# EAGLE design HKCV4 (EAGLE 9.6.2)
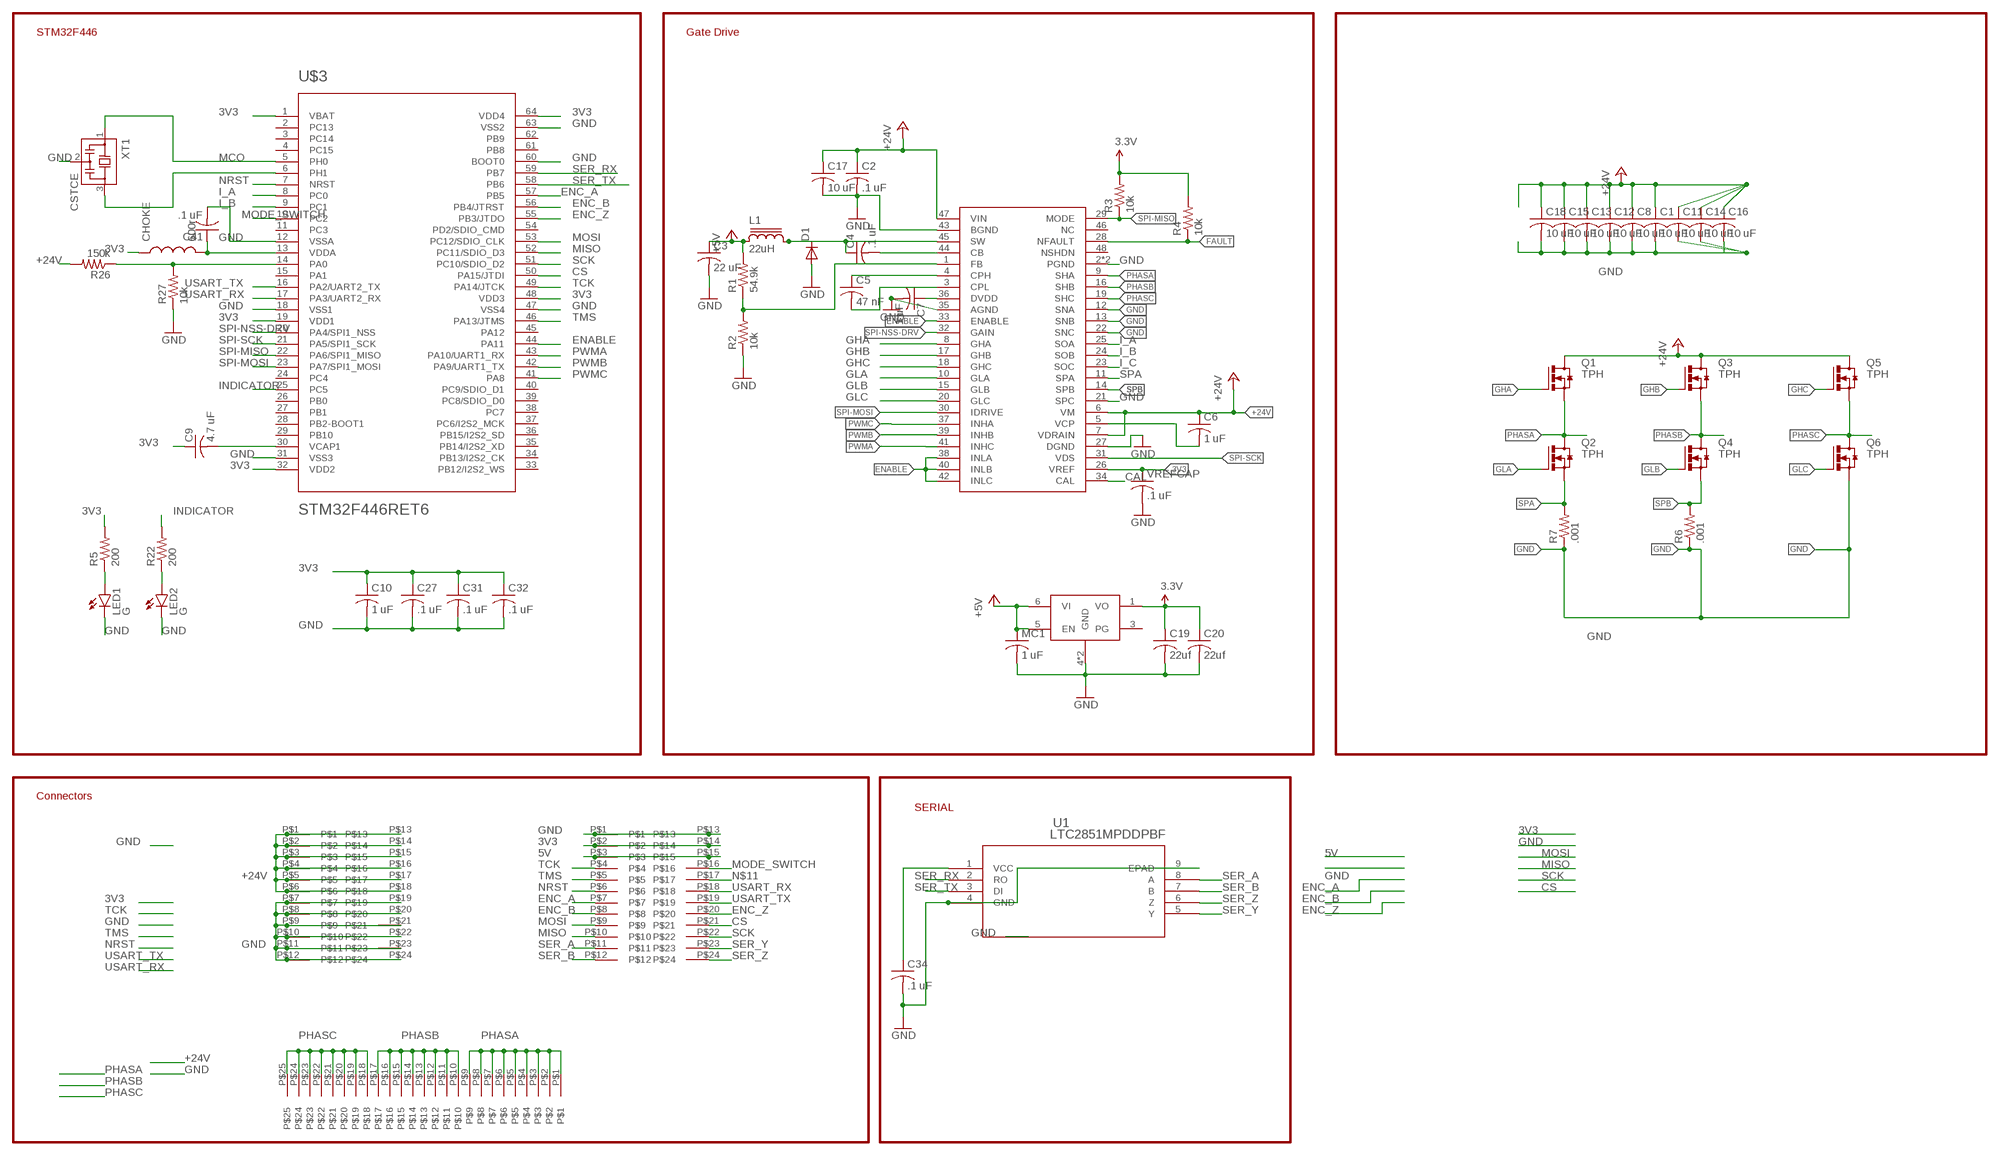
[diagram p0: schematic, sheet 1]

## Parts
C1  10 uF  C-USC1206K  [C1206K]
C2  .1 uF  C-USC0402K  [C0402K]
C3  22 uF  C-USC0603K  [C0603K]
C4  .1 uF  C-USC0402K  [C0402K]
C5  47 nF  C-USC0402K  [C0402K]
C6  1 uF  C-USC0603K  [C0603K]
C7  1 uF  C-USC0402K  [C0402K]
C8  10 uF  C-USC1206K  [C1206K]
C9  4.7 uF  C-USC0402K  [C0402K]
C10  1 uF  C-USC0402K  [C0402K]
C11  10 uF  C-USC1206K  [C1206K]
C12  10 uF  C-USC1206K  [C1206K]
C13  10 uF  C-USC1206K  [C1206K]
C14  10 uF  C-USC1206K  [C1206K]
C15  10 uF  C-USC1206K  [C1206K]
C16  10 uF  C-USC1206K  [C1206K]
C17  10 uF  C-USC1206K  [C1206K]
C18  10 uF  C-USC1206K  [C1206K]
C19  22uf  C-USC0603K  [C0603K]
C20  22uf  C-USC0603K  [C0603K]
C27  .1 uF  C-USC0402K  [C0402K]
C31  .1 uF  C-USC0402K  [C0402K]
C32  .1 uF  C-USC0402K  [C0402K]
C34  .1 uF  C-USC0402K  [C0402K]
C41  .1 uF  C-USC0402K  [C0402K]
CHOKE  600r  INDUCTOR0603  [0603]
D1  DIODE-SOD123  [SOD123]
L1  22uH  SDR0302  [SDR0302]
LED1  G  LED0603  [LED-0603]
LED2  G  LED0603  [LED-0603]
MC1  1 uF  C-USC0402K  [C0402K]
Q1  TPH  [TRANS_TPH5900CNH,L1Q]
Q2  TPH  [TRANS_TPH5900CNH,L1Q]
Q3  TPH  [TRANS_TPH5900CNH,L1Q]
Q4  TPH  [TRANS_TPH5900CNH,L1Q]
Q5  TPH  [TRANS_TPH5900CNH,L1Q]
Q6  TPH  [TRANS_TPH5900CNH,L1Q]
R1  54.9k  R-US_R0402  [R0402]
R2  10k  R-US_R0402  [R0402]
R3  10k  R-US_R0402  [R0402]
R4  10k  R-US_R0402  [R0402]
R5  200  R-US_R0402  [R0402]
R6  .001  R-US_R1210  [R1210]
R7  .001  R-US_R1210  [R1210]
R22  200  R-US_R0402  [R0402]
R26  150k  R-US_R0402  [R0402]
R27  10k  R-US_R0402  [R0402]
U1  LTC2851MPDDPBF  [DFN-8_DD]
U$1  DRV8323RH  [QFN50P700X700X90-49N]
U$2  HEADER_2X12  [2X12X.05]
U$3  STM32F446RET6  [TQFP64]
U$4  HEADER_1X25  [1X25X.05]
U$5  HEADER_2X12  [2X12X.05]
U$7  LDFM  [DFN6-3X3]
VREFCAP  .1 uF  C-USC0402K  [C0402K]
XT1  CSTCE  [CSTCE]

## Nets
3V3: C9.1 C10.1 C19.1 C20.1 C27.1 C31.1 C32.1 C34.1 CHOKE.1 R3.2 R4.2 R5.2 U1.1(VCC) U$1.26(VREF) U$2.P$2 U$2.P$14 U$3.1(VBAT) U$3.19(VDD1) U$3.32(VDD2) U$3.48(VDD3) U$3.64(VDD4) U$7.1(VO) VREFCAP.1 ; supply symbol labelled 3.3V
5V: C3.1 L1.1 MC1.1 R1.2 U$2.P$3 U$2.P$15 U$7.5(EN) U$7.6(VI) ; supply symbol labelled +5V
+24V: C1.1 C2.1 C6.1 C8.1 C11.1 C12.1 C13.1 C14.1 C15.1 C16.1 C17.1 C18.1 Q1.5(D) Q1.6(D) Q1.7(D) Q1.8(D) Q1.EP(D) Q3.5(D) Q3.6(D) Q3.7(D) Q3.8(D) Q3.EP(D) Q5.5(D) Q5.6(D) Q5.7(D) Q5.8(D) Q5.EP(D) R26.2 U$1.6(VM) U$1.7(VDRAIN) U$1.47(VIN) U$5.P$1 U$5.P$2 U$5.P$3 U$5.P$4 U$5.P$5 U$5.P$6 U$5.P$13 U$5.P$14 U$5.P$15 U$5.P$16 U$5.P$17 U$5.P$18
BOOT: C4.2 U$1.44(CB)
CAL: U$1.34(CAL)
CPH: C5.1 U$1.4(CPH)
CPL: C5.2 U$1.3(CPL)
CS: U$2.P$21 U$3.50(PA15/JTDI)
DEVICE3.3: C7.1 U$1.36(DVDD)
ENABLE: U$1.33(ENABLE) U$1.38(INLA) U$1.40(INLB) U$1.42(INLC) U$3.44(PA11)
ENC_A: U$2.P$7 U$3.57(PB5)
ENC_B: U$2.P$8 U$3.56(PB4/JTRST)
ENC_Z: U$2.P$20 U$3.55(PB3/JTDO)
FAULT: R4.1 U$1.28(NFAULT)
FB: R1.1 R2.2 U$1.1(FB)
GHA: Q1.4(G) U$1.8(GHA)
GHB: Q3.4(G) U$1.17(GHB)
GHC: Q5.4(G) U$1.18(GHC)
GLA: Q2.4(G) U$1.10(GLA)
GLB: Q4.4(G) U$1.15(GLB)
GLC: Q6.4(G) U$1.20(GLC)
GND: C1.2 C2.2 C3.2 C7.2 C8.2 C10.2 C11.2 C12.2 C13.2 C14.2 C15.2 C16.2 C17.2 C18.2 C19.2 C20.2 C27.2 C31.2 C32.2 C34.2 C41.2 D1.A LED1.C LED2.C MC1.2 Q6.1(S) Q6.2(S) Q6.3(S) R2.1 R6.1 R7.1 R27.1 U1.4(GND) U1.9(EPAD) U$1.2(PGND) U$1.12(SNA) U$1.13(SNB) U$1.21(SPC) U$1.22(SNC) U$1.27(DGND) U$1.35(AGND) U$1.43(BGND) U$1.49(PGND) U$2.P$1 U$2.P$13 U$3.12(VSSA) U$3.18(VSS1) U$3.31(VSS3) U$3.47(VSS4) U$3.60(BOOT0) U$3.63(VSS2) U$5.P$7 U$5.P$8 U$5.P$9 U$5.P$10 U$5.P$11 U$5.P$12 U$5.P$19 U$5.P$20 U$5.P$21 U$5.P$22 U$5.P$23 U$5.P$24 U$7.4(GND) U$7.EXP(GND) VREFCAP.2 XT1.2
I_A: U$1.25(SOA) U$3.8(PC0)
I_B: U$1.24(SOB) U$3.9(PC1)
I_C: U$1.23(SOC)
INDICATOR: R22.2 U$3.25(PC5)
MCO: U$3.5(PH0) XT1.1
MISO: U$2.P$10 U$3.52(PC11/SDIO_D3)
MODE_SWITCH: U$2.P$16 U$3.10(PC2)
MOSI: U$2.P$9 U$3.53(PC12/SDIO_CLK)
N$1: LED1.A R5.1
N$2: C41.1 CHOKE.2 U$3.13(VDDA)
N$3: C9.2 U$3.30(VCAP1)
N$11: U$2.P$17
N$24: R26.1 R27.2 U$3.14(PA0)
N$28: LED2.A R22.1
N$30: U$3.6(PH1) XT1.3
NRST: U$2.P$6 U$3.7(NRST)
PHASA: Q1.1(S) Q1.2(S) Q1.3(S) Q2.5(D) Q2.6(D) Q2.7(D) Q2.8(D) Q2.EP(D) U$1.9(SHA) U$4.P$1 U$4.P$2 U$4.P$3 U$4.P$4 U$4.P$5 U$4.P$6 U$4.P$7 U$4.P$8 U$4.P$9
PHASB: Q3.1(S) Q3.2(S) Q3.3(S) Q4.5(D) Q4.6(D) Q4.7(D) Q4.8(D) Q4.EP(D) U$1.16(SHB) U$4.P$10 U$4.P$11 U$4.P$12 U$4.P$13 U$4.P$14 U$4.P$15 U$4.P$16 U$4.P$17
PHASC: Q5.1(S) Q5.2(S) Q5.3(S) Q6.5(D) Q6.6(D) Q6.7(D) Q6.8(D) Q6.EP(D) U$1.19(SHC) U$4.P$18 U$4.P$19 U$4.P$20 U$4.P$21 U$4.P$22 U$4.P$23 U$4.P$24 U$4.P$25
PWMA: U$1.41(INHC) U$3.43(PA10/UART1_RX)
PWMB: U$1.39(INHB) U$3.42(PA9/UART1_TX)
PWMC: U$1.37(INHA) U$3.41(PA8)
SCK: U$2.P$22 U$3.51(PC10/SDIO_D2)
SER_A: U1.8(A) U$2.P$11
SER_B: U1.7(B) U$2.P$12
SER_RX: U1.2(RO) U$3.59(PB7)
SER_TX: U1.3(DI) U$3.58(PB6)
SER_Y: U1.5(Y) U$2.P$23
SER_Z: U1.6(Z) U$2.P$24
SPA: Q2.1(S) Q2.2(S) Q2.3(S) R7.2 U$1.11(SPA)
SPB: Q4.1(S) Q4.2(S) Q4.3(S) R6.2 U$1.14(SPB)
SPI-MISO: R3.1 U$1.29(MODE) U$3.22(PA6/SPI1_MISO)
SPI-MOSI: U$1.30(IDRIVE) U$3.23(PA7/SPI1_MOSI)
SPI-NSS-DRV: U$1.32(GAIN) U$3.20(PA4/SPI1_NSS)
SPI-SCK: U$1.31(VDS) U$3.21(PA5/SPI1_SCK)
SW: C4.1 D1.C L1.2 U$1.45(SW)
TCK: U$2.P$4 U$3.49(PA14/JTCK)
TMS: U$2.P$5 U$3.46(PA13/JTMS)
USART_RX: U$2.P$18 U$3.17(PA3/UART2_RX)
USART_TX: U$2.P$19 U$3.16(PA2/UART2_TX)
VCP: C6.2 U$1.5(VCP)
Unconnected: U$1.46(NC) U$1.48(NSHDN) U$3.2(PC13) U$3.3(PC14) U$3.4(PC15) U$3.11(PC3) U$3.15(PA1) U$3.24(PC4) U$3.26(PB0) U$3.27(PB1) U$3.28(PB2-BOOT1) U$3.29(PB10) U$3.33(PB12/I2S2_WS) U$3.34(PB13/I2S2_CK) U$3.35(PB14/I2S2_XD) U$3.36(PB15/I2S2_SD) U$3.37(PC6/I2S2_MCK) U$3.38(PC7) U$3.39(PC8/SDIO_D0) U$3.40(PC9/SDIO_D1) U$3.45(PA12) U$3.54(PD2/SDIO_CMD) U$3.61(PB8) U$3.62(PB9) U$7.3(PG)

## Notes on the sheet
- STM32F446 | Gate Drive
- Connectors
- SERIAL

## Library data of the parts
C1-C20 C27 C31 C32 C34 C41 MC1 VREFCAP = rcl:C-US: CAPACITOR, American symbol
CHOKE = SparkFun-Passives:INDUCTOR: Inductors Basic Inductor/Choke - 0603 and 1206. Footprints are not proven and vary greatly between part numbers. INDUCTOR POWER 3.3UH 4.0A SMD 0.197" L x 0.197" W x 0.177" H (5.00mm x 5.00mm x 4.50mm)
D1 = diode:DIODE-: DIODE
L1 = inductor-bourns:SDR0302: POWER INDUCTOR
LED1 LED2 = SparkFun-LED:LED: LEDs Standard schematic elements and footprints for 5mm, 3mm, 1206, and 0603 sized LEDs. 5mm - Spark Fun Electronics SKU : COM-00529 (and others)
Q1-Q6 = transistor-power:TPH
R1-R7 R22 R26 R27 = rcl:R-US_: RESISTOR, American symbol
U1 = LTC2851MPDDPBF:LTC2851MPDDPBF; DESCRIPTION: LTC2851 - 3.3V 20Mbps RS485/RS422 Transceiver; DIGI-KEY_PART_NUMBER: LTC2851MPDD#PBF-ND; DIGI-KEY_PURCHASE_URL: https://www.digikey.com/product-detail/en/linear-technology-analog-devices/LTC2851MPDD-PBF/LTC2851MPDD-PBF-ND/2297587?utm_source=snapeda&utm_medium=aggregator&utm_campaign=symbol; MF: Linear Technology; MP: LTC2851MPDD#PBF; PACKAGE: DFN-8 Linear Technology
U$1 = BenLibrary:DRV8323RH
U$2 U$5 = Ben_Library:HEADER_2X12
U$3 = BenLibrary:STM32F446RET6: ARM DSP Chip used on the WAV Trigger board.
U$4 = Ben_Library:HEADER_1X25
U$7 = BenLibrary:LDFM
XT1 = sc_usercreated:CSTCE

## Board
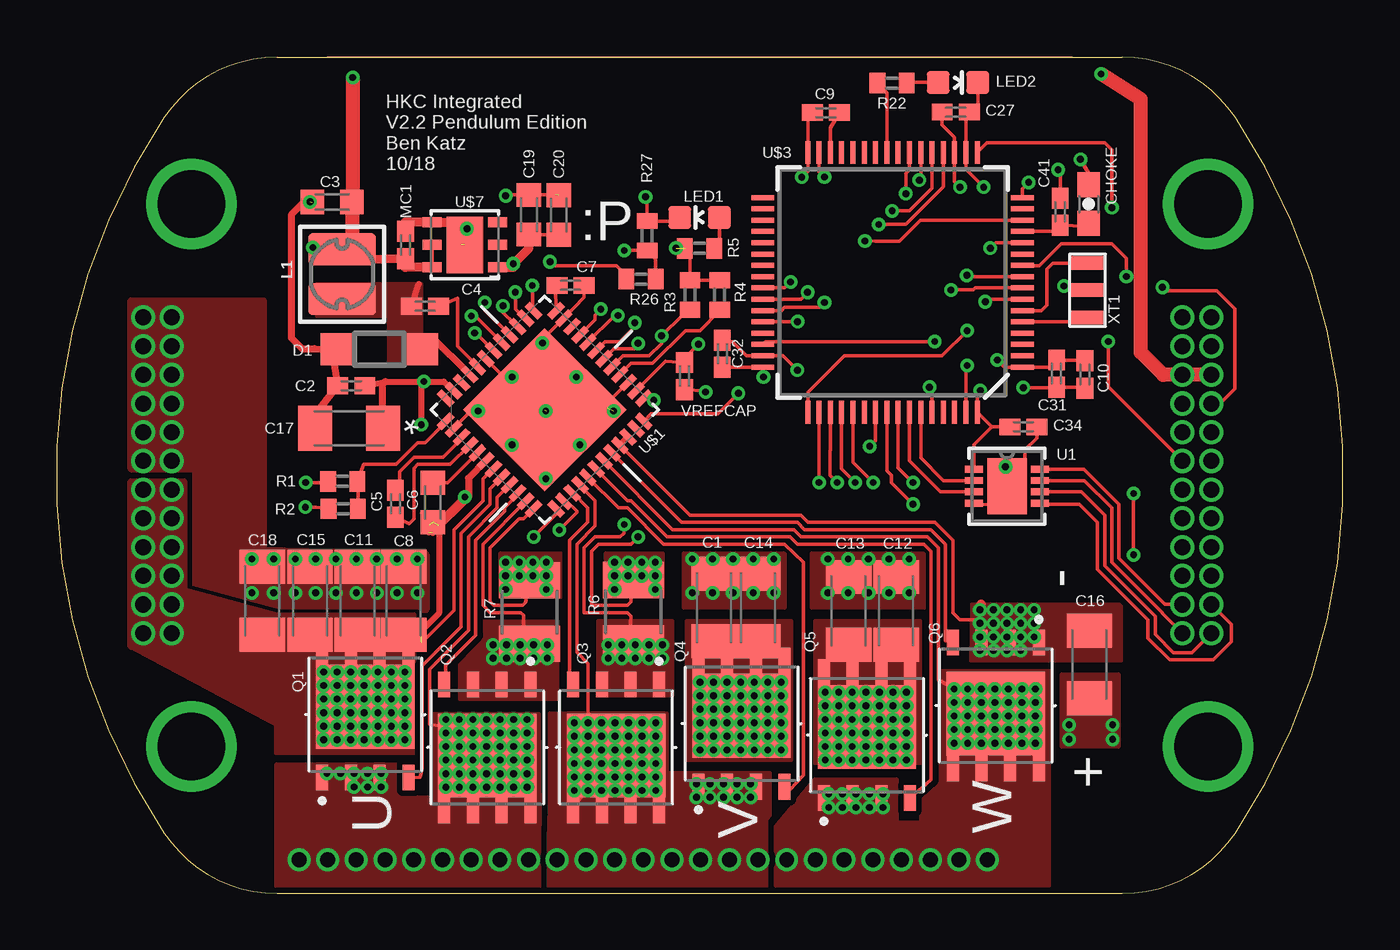
[diagram p1: board, top side]
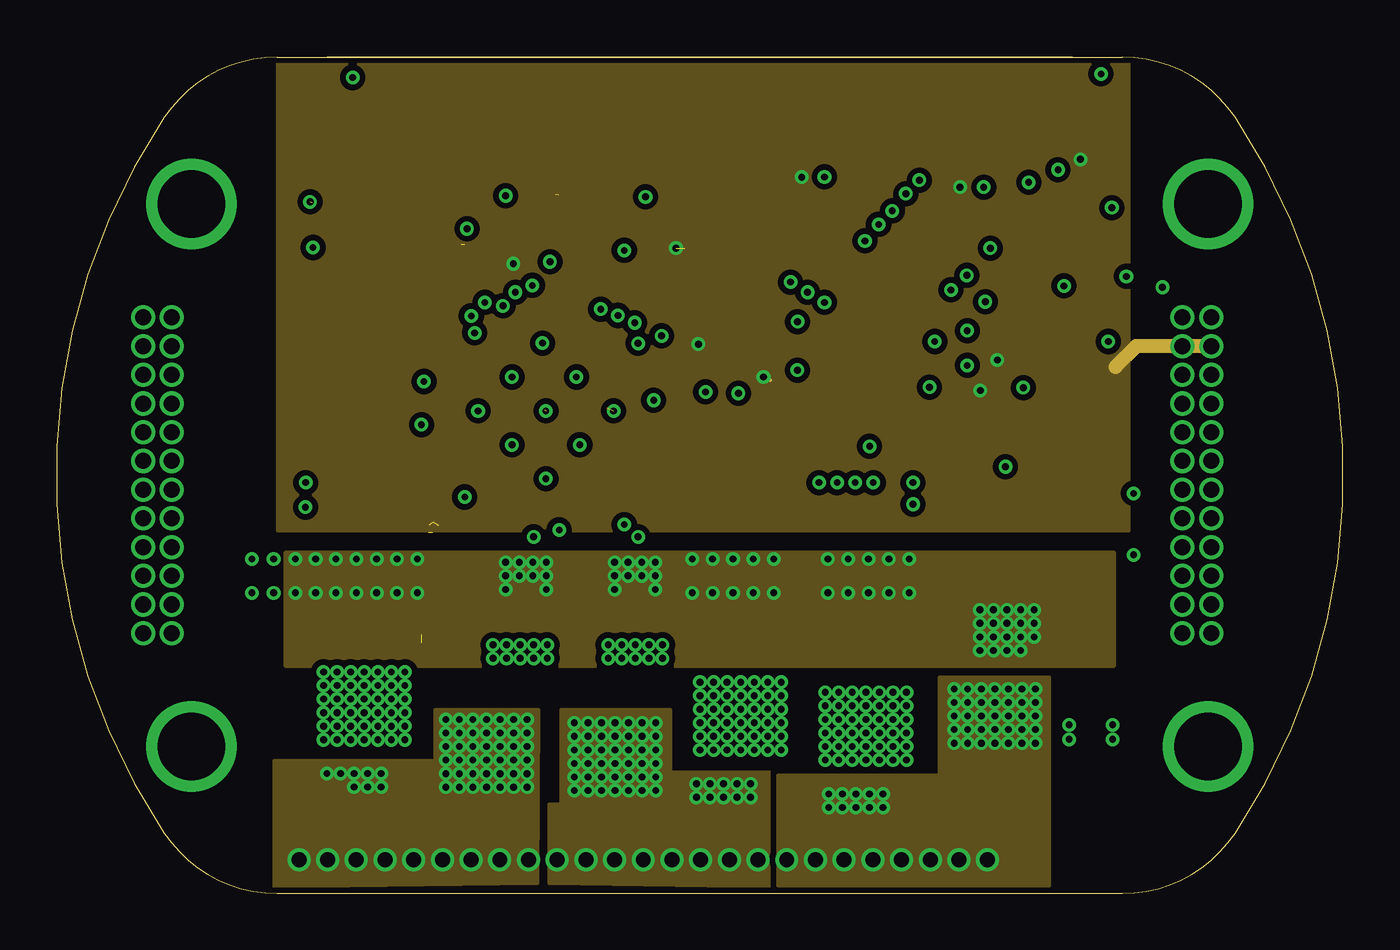
[diagram p2: board, inner layer Route2]
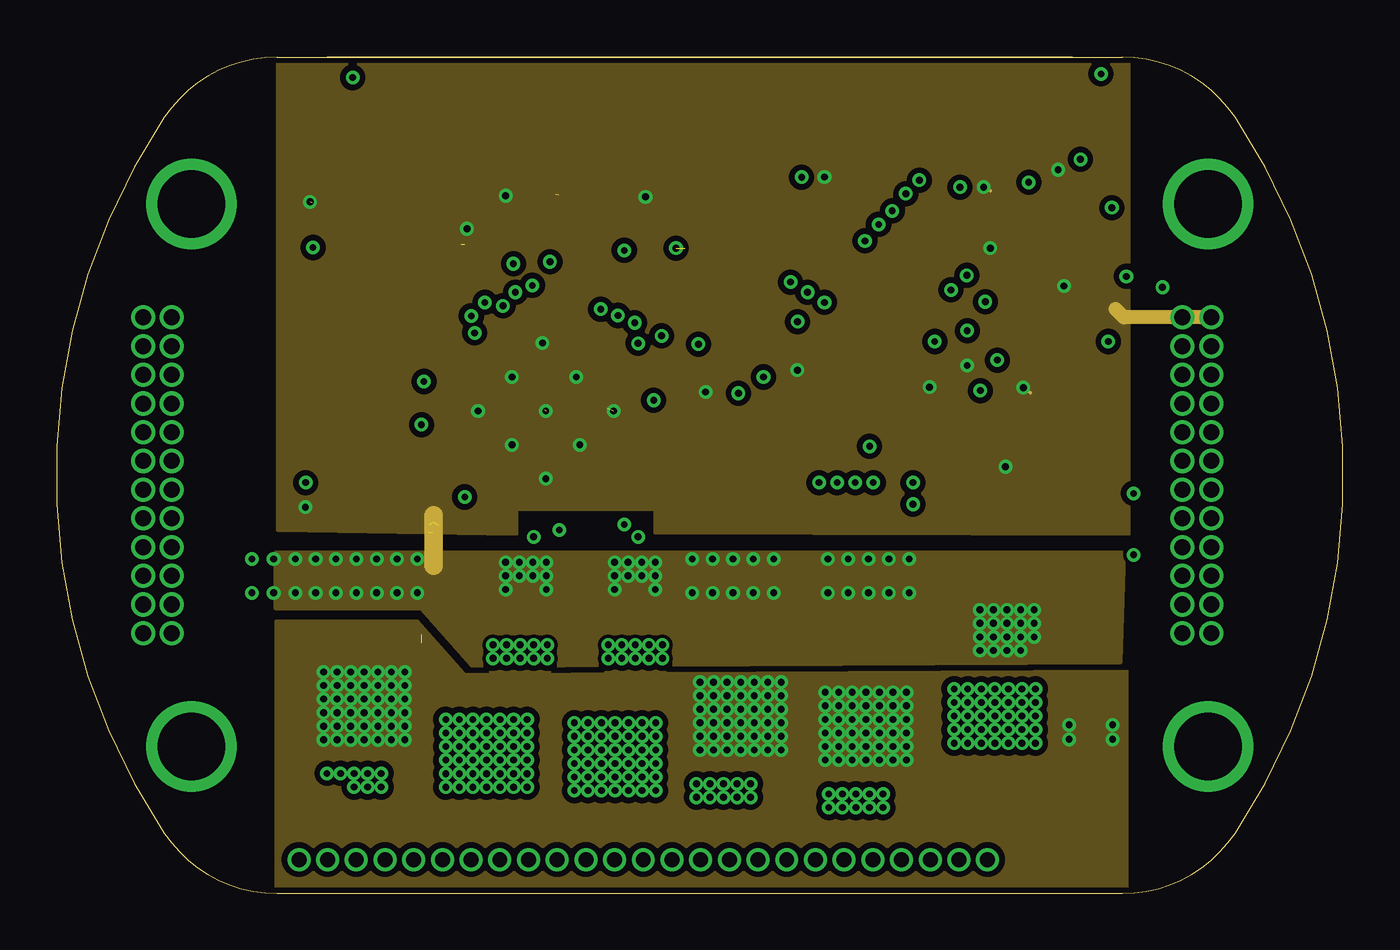
[diagram p3: board, inner layer Route3]
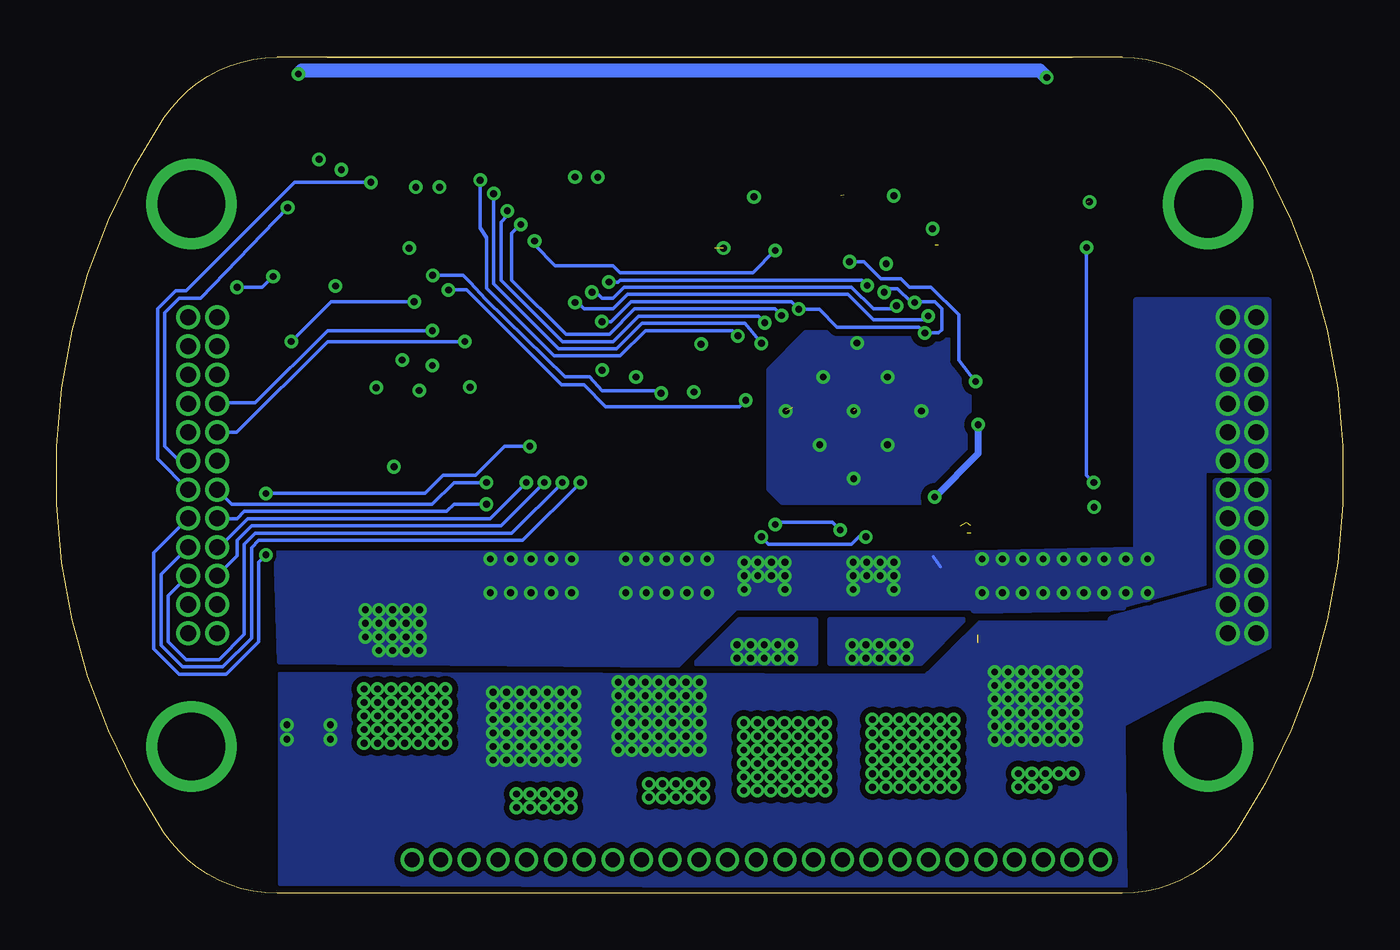
[diagram p4: board, bottom side, seen from below]

Size 56.94 x 37 mm. Coordinates in mm from the lower left corner, seen from the top.
Outline: 11.97,0 44.97,0
Outline: 44.97,37 11.97,37
Outline: 4.77,34.33 arc67 4.77,2.67 arc56 9.76,0 47.18,0 arc56 52.17,2.67 arc67 52.17,34.33 arc56 47.18,37 9.76,37 arc56 4.77,34.33
Copper layers (1*2+3*16): Top 0.035mm / dielectric 1.5mm / Route2 0.035mm / dielectric 0.15mm / Route3 0.035mm / dielectric 0.2mm / Bottom 0.035mm
Design rules "default *": minimum track width 6mil, minimum drill 0.3mm, track to track 6mil, track to pad 6mil, pad to pad 6mil, via to via 6mil, smd to smd 6mil, copper to edge 6mil, drill to drill 6mil, minimum pad ring 0.15mm, minimum via ring 0.15mm, stop-mask expansion 4mil, vias tented up to drill 12mil, thermal gap 10mil

### Footprints (pad centres in the part's own frame; a part is rotated, then mirrored left to right if it is on the bottom)
C1206K = smd 1.5 x 2: 1 -1.5,0; 2 1.5,0
C0402K = smd 0.925 x 0.74: 1 -0.6,0; 2 0.6,0
C0603K = smd 1.05 x 1.08: 1 -0.875,0; 2 0.875,0
0603 = smd 1.1 x 1: 1 -0.85,0; 2 0.85,0
SOD123 = smd 1.4 x 1.4: A 1.9,0; C -1.9,0
SDR0302 = smd 3 x 1.4: 1 0,1.1; 2 0,-1.1
LED-0603 = smd 1 x 1: A 0,-0.877; C 0,0.877
TRANS_TPH5900CNH,L1Q = smd 1.13 x 0.53: 1 -2.79,1.905; 2 -2.79,0.635; 3 -2.79,-0.635; 4 -2.79,-1.905 | smd 1.33 x 0.53: 5 2.69,-1.905; 6 2.69,-0.635; 7 2.69,0.635; 8 2.69,1.905 | smd 3.7 x 4.35: EP 0.35,0
R0402 = smd 0.7 x 0.9: 1 -0.65,0; 2 0.65,0
R1210 = smd 1.6 x 2.7: 1 -1.4,0; 2 1.4,0
DFN-8_DD = smd 0.787 x 0.305: 1 -1.46,0.75; 2 -1.46,0.25; 3 -1.46,-0.25; 4 -1.46,-0.75; 5 1.46,-0.75; 6 1.46,-0.25; 7 1.46,0.25; 8 1.46,0.75 | smd 1.753 x 2.489: 9 0,0
QFN50P700X700X90-49N = smd 0.813 x 0.305: 1 -3.454,2.743; 2 -3.454,2.261; 3 -3.454,1.753; 4 -3.454,1.245; 5 -3.454,0.762; 6 -3.454,0.254; 7 -3.454,-0.254; 8 -3.454,-0.762; 9 -3.454,-1.245; 10 -3.454,-1.753; 11 -3.454,-2.261; 12 -3.454,-2.743; 25 3.454,-2.743; 26 3.454,-2.261; 27 3.454,-1.753; 28 3.454,-1.245; 29 3.454,-0.762; 30 3.454,-0.254; 31 3.454,0.254; 32 3.454,0.762; 33 3.454,1.245; 34 3.454,1.753; 35 3.454,2.261; 36 3.454,2.743 | smd 0.305 x 0.813: 13 -2.743,-3.454; 14 -2.261,-3.454; 15 -1.753,-3.454; 16 -1.245,-3.454; 17 -0.762,-3.454; 18 -0.254,-3.454; 19 0.254,-3.454; 20 0.762,-3.454; 21 1.245,-3.454; 22 1.753,-3.454; 23 2.261,-3.454; 24 2.743,-3.454; 37 2.743,3.454; 38 2.261,3.454; 39 1.753,3.454; 40 1.245,3.454; 41 0.762,3.454; 42 0.254,3.454; 43 -0.254,3.454; 44 -0.762,3.454; 45 -1.245,3.454; 46 -1.753,3.454; 47 -2.261,3.454; 48 -2.743,3.454 | smd 5.105 x 5.105: 49 0,0
2X12X.05 = drill 0.711 pad 1.016: P$1 -0.635,6.985; P$2 -0.635,5.715; P$3 -0.635,4.445; P$4 -0.635,3.175; P$5 -0.635,1.905; P$6 -0.635,0.635; P$7 -0.635,-0.635; P$8 -0.635,-1.905; P$9 -0.635,-3.175; P$10 -0.635,-4.445; P$11 -0.635,-5.715; P$12 -0.635,-6.985; P$13 0.635,6.985; P$14 0.635,5.715; P$15 0.635,4.445; P$16 0.635,3.175; P$17 0.635,1.905; P$18 0.635,0.635; P$19 0.635,-0.635; P$20 0.635,-1.905; P$21 0.635,-3.175; P$22 0.635,-4.445; P$23 0.635,-5.715; P$24 0.635,-6.985
TQFP64 = smd 0.22 x 1: 1 -3.75,-5.75; 2 -3.25,-5.75; 3 -2.75,-5.75; 4 -2.25,-5.75; 5 -1.75,-5.75; 6 -1.25,-5.75; 7 -0.75,-5.75; 8 -0.25,-5.75; 9 0.25,-5.75; 10 0.75,-5.75; 11 1.25,-5.75; 12 1.75,-5.75; 13 2.25,-5.75; 14 2.75,-5.75; 15 3.25,-5.75; 16 3.75,-5.75; 33 3.75,5.75; 34 3.25,5.75; 35 2.75,5.75; 36 2.25,5.75; 37 1.75,5.75; 38 1.25,5.75; 39 0.75,5.75; 40 0.25,5.75; 41 -0.25,5.75; 42 -0.75,5.75; 43 -1.25,5.75; 44 -1.75,5.75; 45 -2.25,5.75; 46 -2.75,5.75; 47 -3.25,5.75; 48 -3.75,5.75 | smd 1 x 0.22: 17 5.75,-3.75; 18 5.75,-3.25; 19 5.75,-2.75; 20 5.75,-2.25; 21 5.75,-1.75; 22 5.75,-1.25; 23 5.75,-0.75; 24 5.75,-0.25; 25 5.75,0.25; 26 5.75,0.75; 27 5.75,1.25; 28 5.75,1.75; 29 5.75,2.25; 30 5.75,2.75; 31 5.75,3.25; 32 5.75,3.75; 49 -5.75,3.75; 50 -5.75,3.25; 51 -5.75,2.75; 52 -5.75,2.25; 53 -5.75,1.75; 54 -5.75,1.25; 55 -5.75,0.75; 56 -5.75,0.25; 57 -5.75,-0.25; 58 -5.75,-0.75; 59 -5.75,-1.25; 60 -5.75,-1.75; 61 -5.75,-2.25; 62 -5.75,-2.75; 63 -5.75,-3.25; 64 -5.75,-3.75
1X25X.05 = drill 0.66 pad 1.016: P$1 0,15.24; P$2 0,13.97; P$3 0,12.7; P$4 0,11.43; P$5 0,10.16; P$6 0,8.89; P$7 0,7.62; P$8 0,6.35; P$9 0,5.08; P$10 0,3.81; P$11 0,2.54; P$12 0,1.27; P$13 0,0; P$14 0,-1.27; P$15 0,-2.54; P$16 0,-3.81; P$17 0,-5.08; P$18 0,-6.35; P$19 0,-7.62; P$20 0,-8.89; P$21 0,-10.16; P$22 0,-11.43; P$23 0,-12.7; P$24 0,-13.97; P$25 0,-15.24
DFN6-3X3 = smd 0.85 x 0.45: 1 -1.45,1; 2 -1.45,0; 3 -1.45,-1; 4 1.45,-1; 5 1.45,0; 6 1.45,1 | smd 1.6 x 2.5: EXP 0,0
CSTCE = smd 0.6 x 1.6: 1 -1.2,0; 2 0,0; 3 1.2,0

### Placement (x,y rotation side)
C1  29.1,12.65 90 top
C2  13.05,22.46 180 top
C3  12.2,30.59 180 top
C4  16.31,25.98 0 top
C5  15,17.24 90 top
C6  16.66,17.3 90 top
C7  22.75,26.9 0 top
C8  15.37,12.95 90 top
C9  34.05,34.55 0 top
C10  45.51,22.96 270 top
C11  13.32,12.95 90 top
C12  37.16,12.5 90 top
C13  35.06,12.5 90 top
C14  31.04,12.65 90 top
C15  11.22,12.95 90 top
C16  45.72,10.13 90 top
C17  12.95,20.58 180 top
C18  9.11,12.95 90 top
C19  20.91,30.03 90 top
C20  22.23,30.02 90 top
C27  39.8,34.57 0 top
C31  44.26,23 270 top
C32  29.47,23.88 90 top
C34  42.8,20.64 0 top
C41  44.42,30.16 90 top
CHOKE  45.68,30.5 270 top
D1  14.29,24.08 180 top
L1  12.64,27.4 0 top
LED1  28.46,29.91 90 top
LED2  39.9,35.88 270 top
MC1  15.45,28.69 90 top
Q1  13.67,7.91 90 top
Q2  19.07,6.46 270 top
Q3  30.32,7.51 90 top
Q4  24.77,6.46 270 top
Q5  35.87,7.01 90 top
Q6  41.57,8.31 270 top
R1  12.67,18.23 180 top
R2  12.69,17.02 0 top
R3  28.04,26.48 90 top
R4  29.35,26.48 90 top
R5  28.46,28.54 180 top
R6  25.53,12.47 270 top
R7  20.93,12.45 270 top
R22  36.98,35.85 180 top
R26  25.87,27.18 180 top
R27  26.14,29.1 270 top
U1  42.07,18.02 0 top
U$1  21.61,21.4 45 top
U$2  50.47,18.5 0 top
U$3  37,27.04 90 top
U$4  25.97,1.5 90 top
U$5  4.47,18.5 180 top
U$7  18.07,28.7 180 top
VREFCAP  27.8,22.89 270 top
XT1  45.63,26.69 90 top

### Tracks (layer width: path | path; a pad name or v marks a point on that pad's centre or on a via)
3V3  (via drill 0.3)  (1 unrouted)
  Top 0.16: R4.2 R3.2 28.04,28.31 R5.2 | v31.29,22.85 31.25,22.89 U$3.48 C32.1 | v40.89,22.25 40.75,22.11 U$3.64 41.4,20.64 | v41.64,23.6 41.95,23.29 U$3.1 44.26,23.29 C31.1 45.51,23.6 C10.1 | v39.99,31.25 39.75,31.49 U$3.19 39.75,33.46 39.19,34.02 C27.1 | CHOKE.1 45.68,31.88 v45.32,32.48 | C9.1 33.25,34.31 U$3.32 33.25,31.96 v32.98,31.69 | U$1.26 26.95,23.54 VREFCAP.1 27.8,23.69 v28.41,24.3 | C20.1 20.92,29.15 C19.1 | C34.1 41.4,20.64 | U1.1 40.61,19.85 41.4,20.64
  Top 0.406: U$7.1 20.22,27.7 v20.22,27.86 20.91,28.55 C19.1
  Route2 0.16: v31.29,22.85 31.44,22.85 31.59,22.7 | v40.89,22.25 41.04,22.4 | v41.64,23.6 41.64,23.75 | v39.99,31.25 40.14,31.1
  Route2 0.61: U$2.P$14 U$2.P$2 47.79,24.21 46.87,23.3
  other vias: 27.42,28.55
  pour Route2 (isolate 0.254, no thermals): 9.79,16.05 47.47,16.05 47.47,37.5 9.79,37.5
5V  (via drill 0.3)
  Top 0.16: U$7.6 U$7.5 | 13.62,28.04 11.89,28.04 v11.35,28.58 | v11.03,18.18 11.97,18.18 R1.2
  Top 0.2: 13.62,28.5 13.22,28.9
  Top 0.26: 13.67,28.95 13.22,28.9 L1.1
  Top 0.406: 13.62,28.5 13.62,28.04 MC1.1 15.45,27.7 U$7.6
  Top 0.61: v46.23,36.26 47.99,35.14 47.99,23.94 48.99,22.95 U$2.P$3 U$2.P$15 | v13.11,36.1 13.11,30.62 C3.1 13.08,29.05 13.22,28.9
  Bottom 0.16: v11.35,28.58 11.35,18.5 v11.03,18.18
  Bottom 0.61: v46.23,36.26 46.07,36.42 13.43,36.42 v13.11,36.1
+24V  (via drill 0.3, 0.3 pad 0.25)  (4 unrouted)
  Top 0.16: Q1.5 15.33,7.71 | C6.1 16.17,16.84 | 16.17,11.45 15.99,11.45 C8.1 | 16.15,11.09 17.59,12.53 17.59,16.1 18.87,17.38 18.87,18.34 19.31,18.78 U$1.7 | R26.2 25.22,27.35 24.79,27.78 22.01,27.78 v21.84,27.95
  Top 0.25: 16.93,15.96 16.93,16.26
  Top 0.26: 16.49,16.28 16.47,15.96 | v16.26,22.65 17.14,22.65 U$1.47 | C2.1 14.55,22.65 v16.26,22.65 | 16.93,15.96 16.93,12.39 15.99,11.45 | v16.15,20.74 16.15,22.54 v16.26,22.65
  Top 0.305: C17.1 14.43,22.53 14.55,22.65 | U$1.6 18.23,18.38 18.23,17.54 16.65,15.96 | v18.07,17.54 16.64,16.11 C6.1
  Bottom 0.16: v16.26,22.65 17.01,23.6 17.01,25.6 18.23,26.82 19.18,26.82 19.56,27.2 20.46,27.2 21.21,27.95 v21.84,27.95
  Bottom 0.305: v16.15,20.74 16.15,19.46 v18.07,17.54
  other vias: 37.62,8.3 37.62,7.7 37.62,7.1 37.62,6.5 37.62,5.9 34.02,8.3 34.02,7.7 34.02,7.1 34.02,6.5 34.02,5.9 34.62,8.3 34.62,7.7 34.62,7.1 34.62,6.5 34.62,5.9 35.22,8.3 35.22,7.7 35.22,7.1 35.22,6.5 35.22,5.9 35.82,8.3 35.82,7.7 35.82,7.1 35.82,6.5 35.82,5.9 36.42,8.3 36.42,7.7 36.42,7.1 36.42,6.5 36.42,5.9 37.02,8.3 37.02,7.7 37.02,7.1 37.02,6.5 37.02,5.9 28.48,8.75 28.48,8.15 28.48,7.55 28.48,6.95 28.48,6.35 29.08,8.75 29.08,8.15 29.08,7.55 29.08,6.95 29.08,6.35 29.68,8.75 29.68,8.15 29.68,7.55 29.68,6.95 29.68,6.35 30.28,8.75 30.28,8.15 30.28,7.55 30.28,6.95 30.28,6.35 30.88,8.75 30.88,8.15 30.88,7.55 30.88,6.95 30.88,6.35 31.48,8.75 31.48,8.15 31.48,7.55 31.48,6.95 31.48,6.35 32.08,8.75 32.08,8.15 32.08,7.55 32.08,6.95 32.08,6.35 11.82,9.2 11.82,8.6 11.82,8 11.82,7.4 11.82,6.8 12.42,9.2 12.42,8.6 12.42,8 12.42,7.4 12.42,6.8 13.02,9.2 13.02,8.6 13.02,8 13.02,7.4 13.02,6.8 13.62,9.2 13.62,8.6 13.62,8 13.62,7.4 13.62,6.8 14.22,9.2 14.22,8.6 14.22,8 14.22,7.4 14.22,6.8 14.82,9.2 14.82,8.6 14.82,8 14.82,7.4 14.82,6.8 15.42,9.2 15.42,8.6 15.42,8 15.42,7.4 15.42,6.8 34.02,8.9 34.62,8.9 35.22,8.9 35.82,8.9 36.42,8.9 37.02,8.9 37.62,8.9 28.48,9.35 29.08,9.35 29.68,9.35 30.28,9.35 30.88,9.35 31.48,9.35 32.08,9.35 11.82,9.8 12.42,9.8 13.02,9.8 13.62,9.8 14.22,9.8 14.82,9.8 15.42,9.8 44.82,7.46 46.74,7.46 46.74,6.82 44.82,6.82
  pour Bottom (isolate 0.254, rank 2, no thermals): 47.07,9.75 18.49,9.65 16.09,12 9.77,12 9.62,0.25 47.07,0.4
  pour Top (no thermals): 33.58,12.07 38.23,12.07 38.23,5.75 33.58,5.75
  pour Top (no thermals): 32.53,5.9 32.53,12.07 27.88,12.07 27.88,5.9
  pour Top (isolate 0.254, no thermals): 9.71,6.2 15.84,6.2 15.84,12.35 9.71,12.35
  pour Route3 (isolate 0.254, rank 3, no thermals): 9.72,12.05 16.09,12.05 18.17,9.8 47.37,9.95 47.37,-0.55 9.72,-0.55
  pour Bottom (isolate 0.25, rank 2, no thermals): 3.35,18.18 5.59,18.18 5.59,13.38 10.23,12.1 10.23,7.3 3.35,10.98
  pour Top (isolate 0.25, rank 2, no thermals): 3.35,18.18 5.59,18.18 5.59,13.38 10.23,12.1 10.23,7.3 3.35,10.98
  pour Top (no thermals): 44.47,9.7 47.03,9.7 47.03,6.5 44.47,6.5
BOOT
  Top 0.16: C4.2 17.76,26.34 17.76,24.2 18.6,23.36 U$1.44
CPH
  Top 0.16: C5.1 15.62,16.37 15.83,16.58 15.83,18.82 15.99,18.98 17.43,18.98 U$1.4
CPL
  Top 0.16: U$1.3 17.93,20.12 17.11,19.3 15.83,19.3 15.19,18.66 15.19,18.3 C5.2
CS  (via drill 0.3)
  Top 0.16: v33.75,18.18 U$3.50
  Bottom 0.16: v33.75,18.18 36.31,15.62 47.99,15.62 48.31,15.3 48.31,11.3 49.59,10.02 51.35,10.02 52.31,10.98 52.31,14.12 U$2.P$21
DEVICE3.3
  Top 0.16: U$1.36 22.08,26.83 C7.1
ENABLE  (via drill 0.3)
  Top 0.16: U$3.44 31.29,25.25 31.34,25.3 v32.8,25.3 | U$1.42 18.4,24.95 v18.51,24.8 | U$1.38 20.71,25.45 20.31,25.85 v20.31,26.6 | U$1.40 18.96,25.79 v18.96,26.15 | U$1.33 23.83,25.38 23.83,25.59 v24.09,25.85
  Bottom 0.16: v20.31,26.6 20.16,26.75 19.71,26.75 19.11,26.15 v18.96,26.15 18.93,26.18 18.07,26.18 17.76,25.87 17.76,24.95 17.91,24.8 v18.51,24.8 18.77,25.06 22.39,25.06 23.18,25.85 v24.09,25.85 24.42,26.18 31.51,26.18 32.39,25.3 v32.8,25.3
ENC_A  (via drill 0.3)
  Top 0.16: U$3.57 37.25,18.84 v37.91,18.18
  Bottom 0.16: v37.91,18.18 39.35,18.18 40.31,17.22 49.19,17.22 U$2.P$7
ENC_B  (via drill 0.3)
  Top 0.16: U$3.56 36.75,18.7 36.95,18.5 36.95,18.18 v37.91,17.22
  Bottom 0.16: v37.91,17.22 39.35,17.22 39.67,16.9 48.63,16.9 48.95,16.58 U$2.P$8
ENC_Z  (via drill 0.3)
  Top 0.16: U$3.55 36.25,20.04 v35.99,19.78 | v47.67,17.7 v47.67,14.98
  Bottom 0.16: v35.99,19.78 37.11,19.78 38.39,18.5 39.83,18.5 40.63,17.7 v47.67,17.7 | U$2.P$20 52.63,15.07 52.63,10.82 51.51,9.7 49.43,9.7 47.99,11.14 47.99,14.66 v47.67,14.98
FAULT
  Top 0.16: U$1.28 25.43,23.46 26.39,23.46 27.83,24.9 28.47,24.9 29.35,25.78 R4.1
FB
  Top 0.16: U$1.1 17.23,20.86 16.31,19.94 15.99,19.94 15.03,18.98 13.59,18.98 R1.1 13.34,18.21 R2.2
GHA
  Top 0.16: U$1.8 19.19,17.9 19.19,17.22 17.91,15.94 17.91,11.8 16.19,10.08 16.19,5.55 16.09,5.15 Q1.4
GHB
  Top 0.16: Q3.4 32.15,4.26 33.07,5.22 33.07,14.66 32.23,15.46 26.87,15.46 25.27,17.06 24.87,17.06 U$1.17
GHC
  Top 0.16: U$1.18 25.27,17.38 25.43,17.38 27.03,15.78 32.47,15.78 32.79,15.46 38.39,15.46 38.71,15.14 38.71,5.03 Q5.4
GLA
  Top 0.16: Q2.4 17.22,9.31 17.22,10.1 18.55,11.43 18.55,15.62 19.83,16.9 19.83,17.06 20.41,17.64 U$1.10
GLB
  Top 0.16: U$1.15 22.85,17.72 23.51,17.06 23.51,16.42 22.71,15.62 22.71,9.41 Q4.4
GLC
  Top 0.16: Q6.4 39.35,11.19 39.35,15.46 38.71,16.1 33.11,16.1 32.79,16.42 27.67,16.42 U$1.20
GND  (via drill 0.3)  (5 unrouted)
  Top 0.16: 20.67,13.1 20.67,14.1 R7.1 20.77,12.88 20.63,12.74 19.35,12.74 19.19,12.9 19.19,15.3 20.47,16.58 20.67,16.58 U$1.12 | U$1.43 21.22,21.41 U$1.49 | U$1.2 18.38,21.41 U$1.49 | U$1.27 24.36,21.71 24.36,21.5 | U$1.49 21.58,24.61 U$1.35 23.35,26.38 C7.2 | v32.79,23.15 32.15,23.79 U$3.47 30.54,23.79 29.91,24.42 29.53,24.42 C32.2 | U$3.12 41.57,28.79 v41.33,28.55 | v41.04,31.25 40.25,32.04 U$3.18 40.25,34.42 C27.2 40.78,34.95 LED2.C | U$3.31 33.75,31.94 v33.99,31.7 | U$3.60 38.75,22.29 v38.64,22.4 | 24.95,19.78 24.95,19.94 25.21,20.2 U$1.22 U$1.21 28.03,16.74 32.95,16.74 33.27,16.42 38.87,16.42 39.67,15.62 39.67,12.42 39.99,12.1 40.72,12.1 v40.87,11.95 | 25.74,13.45 25.43,13.46 25.43,12.9 25.27,12.74 23.67,12.74 23.67,15.14 23.99,15.46 25.43,15.46 v25.74,15.77 v25.74,15.78 | U$3.63 40.25,23.3 v40.31,23.36 | v42.79,22.38 44.26,22.38 C31.2 45.51,22.4 C10.2 | XT1.2 44.62,26.85 v44.59,26.88 | C41.2 44.42,31.93 v44.33,32.02 | 27.69,30.02 LED1.C 27.42,29.75 R27.1 26.14,30.75 v26.07,30.82 | U$1.13 22.11,16.77 v21.12,15.78 | v11.02,17.09 11.49,17.09 R2.1 | v28.73,22.19 28.68,22.24 VREFCAP.2 | 22.09,30.91 C19.2 19.92,30.91 v19.88,30.87 | U1.4 42,17.11 v42,18.88 | v42,18.88 42.07,17.76 U1.9 | C34.2 43.4,20.15 42.87,19.62 42.87,18.63 v42,18.88
  Top 0.26: D1.A 12.18,24.05 | 11.29,30.71 C3.2
  Top 0.3: 12.18,24.05 C2.2
  Top 0.305: D1.A 11.41,24.1 10.87,24.1 10.39,24.58 10.39,30.02 10.97,30.6 v11.22,30.6 | C17.2 11.63,21.41 C2.2 | v18.17,29.41 17.91,28.71
  Top 0.406: 40.92,12.8 v40.87,12.55 | MC1.2 15.45,29.7 U$7.4 18.07,29.7 U$7.EXP
  Route3 0.16: v32.79,23.15 32.64,23.15 32.79,23 | v42.79,22.38 43.1,22.15 | v41.04,31.25 41.34,31.1 | v33.99,31.7 34.14,31.7 | v38.64,22.4 38.49,22.55 | v40.31,23.36 40.16,23.51 | v26.07,30.82 26.07,30.66
  Route3 0.61: U$2.P$13 U$2.P$1 47.25,25.48 46.87,25.86
  Route3 0.813: 16.69,16.74 16.69,14.5
  Bottom 0.16: 18.12,14.9 17.82,14.45 | v21.12,15.78 21.43,15.78 21.75,15.46 25.42,15.46 v25.74,15.78
  other vias: 43.27,11.95 19.88,13.45 18.66,21.35 42.67,11.95 42.07,11.95 41.47,11.95 41.47,12.55 42.07,12.55 42.67,12.55 43.27,12.55 28.14,14.8 26.5,13.45 24.7,13.45 26.5,14.05 25.9,14.05 25.3,14.05 24.7,14.05 24.7,14.65 25.3,14.65 25.9,14.65 26.5,14.65 21.68,13.45 21.68,14.05 21.08,14.05 20.48,14.05 19.88,14.05 19.88,14.65 20.48,14.65 21.08,14.65 21.68,14.65 10.57,14.8 21.66,18.35 24.66,21.35 21.51,24.35 20.16,22.85 23.16,19.85 21.66,21.35 23.01,22.85 20.16,19.85 40.87,11.35 41.47,11.35 42.07,11.35 42.67,11.35 43.27,11.35 42.67,10.75 42.07,10.75 41.47,10.75 40.87,10.75 11.47,14.8 12.37,14.8 13.27,14.8 14.17,14.8 15.07,14.8 15.97,14.8 10.57,13.3 11.47,13.3 12.37,13.3 13.27,13.3 14.17,13.3 15.07,13.3 15.97,13.3 28.14,13.3 29.04,14.8 29.94,14.8 30.84,14.8 31.74,14.8 29.04,13.3 29.94,13.3 30.84,13.3 31.74,13.3 34.14,14.8 35.04,14.8 35.94,14.8 36.84,14.8 37.74,14.8 34.14,13.3 35.04,13.3 35.94,13.3 36.84,13.3 37.74,13.3 9.61,14.8 9.61,13.3 8.65,14.8 8.65,13.3
  pour Route3 (isolate 0.254, no thermals): 9.79,16.06 20.37,15.9 20.37,17 26.48,17 26.48,15.95 47.47,15.9 47.47,37.5 9.79,37.66
  pour Bottom (rank 2, no thermals): 9.72,15.05 47.22,15.05 47.07,10.25 29.45,10.1 26.89,12.65 9.72,12.65
  pour Top (isolate 0.254, rank 2, no thermals): 24.29,13.21 26.84,13.21 26.84,15.05 24.29,15.05
  pour Top (no thermals): 27.74,15.05 32.24,15.05 32.24,12.65 27.74,12.65
  pour Top (no thermals): 33.42,12.65 38.53,12.65 38.53,15.05 33.42,15.05
  pour Top (isolate 0.254, no thermals): 9.72,15.18 16.32,15.18 16.32,12.95 9.72,12.95
  pour Top (isolate 0.254, rank 2, no thermals): 40.52,12.8 47.14,12.8 47.14,10.29 40.47,10.29
  pour Route3 (no thermals): 9.72,15.05 47.22,15.05 47.07,10.25 18.41,10.1 16.17,12.65 9.72,12.65
  pour Top (isolate 0.254, rank 2, no thermals): 22.34,13.1 22.34,15.05 19.63,15.05 19.63,13.1
  pour Route2 (isolate 0.254, rank 4, no thermals): 10.17,15.05 46.77,15.05 46.77,10.1 10.17,10.1
  pour Bottom (isolate 0.305, rank 2, no thermals): 17.31,24.8 23.76,24.8 25.41,23.15 25.41,17.9 24.81,17.3 17.46,17.3 16.56,18.2 16.56,24.05
  pour Bottom (rank 3, no thermals): 3.35,26.18 9.11,26.18 9.11,15.14 16.31,14.98 16.31,12.58 6.23,12.74 6.23,18.82 3.35,18.82
  pour Top (rank 3, no thermals): 3.35,26.18 9.11,26.18 9.11,15.14 16.31,14.98 16.31,12.58 6.23,12.74 6.23,18.82 3.35,18.82
I_A  (via drill 0.3)
  Top 0.16: v39.59,26.7 40.59,26.7 40.68,26.79 U$3.8 | U$1.25 26.35,21.9 v26.43,21.82
  Bottom 0.16: v39.59,26.7 38.79,26.7 34.59,22.5 33.59,22.5 32.63,21.54 26.71,21.54 v26.43,21.82
I_B  (via drill 0.3)
  Top 0.16: U$3.9 40.35,27.29 v40.29,27.35 | v30.18,22.13 29.27,21.22 26.32,21.22 U$1.24
  Bottom 0.16: v40.29,27.35 38.94,27.35 38.64,27.05 37.94,26.3 34.44,22.85 33.35,22.85 32.79,22.25 30.3,22.25 v30.18,22.13
INDICATOR
  Top 0.16: U$3.25 36.75,35.43 R22.2
MCO
  Top 0.16: U$3.5 44.79,25.29 XT1.1
MISO  (via drill 0.3)
  Top 0.16: v35.35,18.18 34.75,18.78 U$3.52
  Bottom 0.16: v35.35,18.18 37.27,16.26 48.31,16.26 48.95,15.62 48.95,14.94 U$2.P$10
MODE_SWITCH  (via drill 0.3)
  Top 0.16: U$2.P$16 51.49,21.68 52.15,22.34 52.15,25.86 51.35,26.66 49.11,26.66 v48.95,26.82 | v47.35,27.3 47.35,28.1 46.71,28.74 44.47,28.74 43.51,27.78 U$3.10
  Bottom 0.16: v48.95,26.82 47.83,26.82 v47.35,27.3
MOSI  (via drill 0.3)
  Top 0.16: v36.15,18.18 35.25,19.08 U$3.53
  Bottom 0.16: v36.15,18.18 37.75,16.58 48.47,16.58 49.43,15.62 49.54,15.62 U$2.P$9
N$1
  Top 0.16: LED1.A 29.34,28.77 R5.1
N$2
  Top 0.16: CHOKE.2 45.54,29.51 C41.1 44.2,29.29 U$3.13
N$3
  Top 0.16: U$3.30 34.25,33.88 C9.2
N$4  (via drill 3)
  other vias: 50.97,30.5
N$5  (via drill 3)
  other vias: 50.97,6.5
N$6  (via drill 3)
  other vias: 5.97,6.5
N$7  (via drill 3)
  other vias: 5.97,30.5
N$24  (via drill 0.3)
  Top 0.16: U$3.14 38.23,29.79 37.3,28.86 36.25,28.86 v35.78,28.87 | R26.1 26.52,28.07 R27.2 v25.13,28.45
  Bottom 0.16: v35.78,28.87 35.78,28.69 34.87,27.78 32.31,27.78 31.99,27.46 26.12,27.46 v25.13,28.45
N$28
  Top 0.16: LED2.A 37.66,35.88 R22.1
N$30
  Top 0.16: XT1.3 44.1,27.89 43.83,27.62 43.83,26.02 43.6,25.79 U$3.6
NRST  (via drill 0.3)
  Top 0.16: U$2.P$6 46.55,22.42 v46.55,24.42 | v41.11,26.18 41.22,26.29 U$3.7
  Bottom 0.16: v46.55,24.42 44.79,26.18 v41.11,26.18
PHASA  (via drill 0.3)
  Top 0.16: U$1.9 19.51,17.54 19.51,17.06 18.23,15.78 18.23,11.64 16.51,9.92 16.51,7.49 17.05,7.4 17.08,7.4
  other vias: 20.83,5.3 20.83,5.9 20.83,6.5 20.83,7.1 20.83,7.7 17.23,5.3 17.23,5.9 17.23,6.5 17.23,7.1 17.23,7.7 17.83,5.3 17.83,5.9 17.83,6.5 17.83,7.1 17.83,7.7 18.43,5.3 18.43,5.9 18.43,6.5 18.43,7.1 18.43,7.7 19.03,5.3 19.03,5.9 19.03,6.5 19.03,7.1 19.03,7.7 19.63,5.3 19.63,5.9 19.63,6.5 19.63,7.1 19.63,7.7 20.23,5.3 20.23,5.9 20.23,6.5 20.23,7.1 20.23,7.7 17.23,4.7 17.83,4.7 18.43,4.7 19.03,4.7 19.63,4.7 20.23,4.7 20.83,4.7 11.97,5.31 12.57,5.31 13.17,5.31 13.77,5.31 14.37,5.31 14.37,4.71 13.77,4.71 13.17,4.71
  pour Top (isolate 0.254, no thermals): 9.72,5.72 15.12,5.72 15.12,4.25 16.59,4.25 16.59,7.95 21.36,7.95 21.4,3.29 21.37,2.73 21.37,0.29 9.72,0.3
  pour Route2 (isolate 0.254, no thermals): 9.64,5.88 16.76,5.88 16.76,8.12 21.34,8.12 21.29,0.45 9.64,0.3
PHASB  (via drill 0.3)
  Top 0.16: Q4.5 24.82,6.4 23.53,8 23.53,10.17 23.03,10.67 23.03,15.46 23.83,16.26 23.83,17.38 23.17,18.04 U$1.16
  other vias: 22.92,5.15 22.92,5.75 22.92,6.35 22.92,6.95 22.92,7.55 23.52,5.15 23.52,5.75 23.52,6.35 23.52,6.95 23.52,7.55 24.12,5.15 24.12,5.75 24.12,6.35 24.12,6.95 24.12,7.55 24.72,5.15 24.72,5.75 24.72,6.35 24.72,6.95 24.72,7.55 25.32,5.15 25.32,5.75 25.32,6.35 25.32,6.95 25.32,7.55 25.92,5.15 25.92,5.75 25.92,6.35 25.92,6.95 25.92,7.55 26.52,5.15 26.52,5.75 26.52,6.35 26.52,6.95 26.52,7.55 22.92,4.55 23.52,4.55 24.12,4.55 24.72,4.55 25.32,4.55 25.92,4.55 26.52,4.55 28.32,4.85 28.92,4.85 29.52,4.85 30.12,4.85 30.72,4.85 28.32,4.25 28.92,4.25 29.52,4.25 30.12,4.25 30.72,4.25
  pour Top (isolate 0.254, rank 2, no thermals): 21.82,7.97 21.82,3.47 21.62,2.35 21.62,0.3 31.58,0.3 31.58,5.35 27.02,5.35 27.02,7.97
  pour Route2 (isolate 0.254, rank 2, no thermals): 22.33,8.12 22.33,3.95 21.8,3.95 21.8,0.46 31.58,0.3 31.58,5.37 27.17,5.37 27.17,8.12
PHASC  (via drill 0.3)
  Top 0.16: v39.73,9.05 39.03,9.46 39.03,15.3 38.55,15.78 32.95,15.78 32.63,16.1 27.27,16.1 U$1.19
  other vias: 43.33,9.05 43.33,8.45 43.33,7.85 43.33,7.25 43.33,6.65 42.73,9.05 42.73,8.45 42.73,7.85 42.73,7.25 42.73,6.65 39.73,8.45 39.73,7.85 39.73,7.25 39.73,6.65 40.33,9.05 40.33,8.45 40.33,7.85 40.33,7.25 40.33,6.65 40.93,9.05 40.93,8.45 40.93,7.85 40.93,7.25 40.93,6.65 41.53,9.05 41.53,8.45 41.53,7.85 41.53,7.25 41.53,6.65 42.13,9.05 42.13,8.45 42.13,7.85 42.13,7.25 42.13,6.65 36.58,4.4 35.98,4.4 35.38,4.4 34.78,4.4 34.18,4.4 34.18,3.8 34.78,3.8 35.38,3.8 35.98,3.8 36.58,3.8
  pour Top (isolate 0.254, no thermals): 33.54,5.05 31.83,2.98 31.83,0.35 43.94,0.35 43.94,9.85 38.27,9.85 38.27,3.15 37.19,3.15 37.19,5.05
  pour Route2 (isolate 0.254, no thermals): 31.94,5.22 31.94,0.35 43.94,0.35 43.94,9.56 39.07,9.56 39.07,5.22
PWMA  (via drill 0.3)
  Top 0.16: U$1.41 18.52,25.55 v18.36,25.55 | 33.96,26.15 v33.99,26.15 33.78,25.94 32.23,25.94 32.08,25.79 U$3.43
  Bottom 0.16: v18.36,25.55 18.53,25.38 20.79,25.38 21.91,26.5 31.67,26.5 32.31,25.86 33.59,25.86 33.88,26.15 v33.99,26.15
PWMB  (via drill 0.3)
  Top 0.16: U$3.42 32.95,26.29 v33.24,26.6 | U$1.39 19.62,25.85 v19.76,26
  Bottom 0.16: v19.76,26 19.85,25.86 20.79,25.86 21.75,26.82 31.83,26.82 32.31,26.34 32.79,26.34 33.05,26.6 v33.24,26.6
PWMC  (via drill 0.3)
  Top 0.16: U$3.41 32.23,26.79 v32.49,27.05 | U$1.37 21.06,25.93 v21.06,26.9
  Bottom 0.16: v21.06,26.9 21.3,27.14 31.99,27.14 32.08,27.05 v32.49,27.05
SCK  (via drill 0.3)
  Top 0.16: U$3.51 34.25,19.6 34.23,19.58 34.23,18.5 v34.55,18.18
  Bottom 0.16: v34.55,18.18 36.79,15.94 48.15,15.94 48.63,15.46 48.63,11.46 49.75,10.34 51.19,10.34 51.99,11.14 51.99,13.17 U$2.P$22
SER_A
  Top 0.16: U1.8 45.48,18.77 47.03,17.22 47.03,14.82 49.07,12.79 U$2.P$11
SER_B
  Top 0.16: U1.7 45.5,18.27 46.71,17.06 46.71,14.66 48.95,12.42 48.95,12.4 U$2.P$12
SER_RX
  Top 0.16: U$3.59 38.25,19.28 39.26,18.27 U1.2
SER_TX
  Top 0.16: U$3.58 37.75,19.14 39.12,17.77 U1.3
SER_Y
  Top 0.16: U1.5 43.58,17.22 45.27,17.22 46.07,16.42 46.07,14.34 48.31,12.1 48.31,11.3 49.27,10.34 51.19,10.34 51.99,11.14 51.99,11.9 U$2.P$23
SER_Z
  Top 0.16: U1.6 45.36,17.77 46.39,16.74 46.39,14.5 48.63,12.26 48.63,11.46 49.43,10.66 50.25,10.66 U$2.P$24
SPA  (via drill 0.3)
  Top 0.16: 20.3,11.28 R7.2 20.67,11.15 20.67,12.3 20.55,12.42 19.19,12.42 18.87,12.74 18.87,15.46 U$1.11 | 20.3,11.28 20.07,11.4 | 20.3,11.29 20.3,11.28
  other vias: 19.32,10.4 19.92,10.4 20.52,10.4 21.12,10.4 21.72,10.4 21.72,11 21.12,11 20.52,11 19.92,11 19.32,11
  pour Top (isolate 0.254, rank 2, no thermals): 17.83,8.6 22.18,8.6 22.18,12.05 17.83,12.05
  pour Bottom (isolate 0.254): 16.79,12.1 22.71,12.1 22.71,10.18 18.71,10.18
SPB  (via drill 0.3)
  Top 0.16: R6.2 25.37,11.36 25.43,12.26 25.27,12.42 23.35,12.42 23.35,15.3 23.83,15.78 24.95,15.78 25.11,15.94 25.11,16.3 v25.13,16.32 | U$1.14 22.57,17.36 23.03,16.9 23.03,16.86 v22.25,16.08
  Bottom 0.16: v25.13,16.32 25.03,16.42 22.59,16.42 v22.25,16.08
  other vias: 24.42,10.4 25.02,10.4 25.62,10.4 26.22,10.4 26.82,10.4 26.82,11 26.22,11 25.62,11 25.02,11 24.42,11
  pour Top (isolate 0.254, rank 2, no thermals): 27.27,12.06 23.97,12.06 23.97,8.75 27.27,8.75
  pour Bottom (isolate 0.254): 23.35,12.1 26.71,12.1 28.63,10.18 23.35,10.18
SPI-MISO  (via drill 0.3)
  Top 0.16: U$3.22 38.25,31.62 v38.19,31.56 | R3.1 28.04,25.59 27.7,25.59 v26.78,24.67 26.78,24.33 26.23,23.78 25.07,23.78 U$1.29
  Bottom 0.16: v38.19,31.56 38.19,29.45 37.91,29.02 37.91,26.77 34.92,23.78 31.99,23.78 30.87,24.9 27.01,24.9 v26.78,24.67
SPI-MOSI  (via drill 0.3)
  Top 0.16: U$3.23 37.75,32.02 37.59,31.86 v37.59,30.96 | v25.74,24.34 25.9,24.41 25.59,24.1 24.67,24.1 U$1.30
  Bottom 0.16: v37.59,30.96 37.59,26.98 34.71,24.1 32.15,24.1 31.03,25.22 26.46,25.22 v25.74,24.34
SPI-NSS-DRV  (via drill 0.3)
  Top 0.16: U$3.20 39.25,31.26 37.59,29.6 v36.39,29.6 | v24.85,25.57 24.7,25.57 U$1.32
  Bottom 0.16: v24.85,25.57 25.14,25.86 31.35,25.86 32.47,24.74 34.39,24.74 36.79,27.14 36.79,29.22 36.41,29.6 v36.39,29.6
SPI-SCK  (via drill 0.3)
  Top 0.16: U$3.21 38.75,31.21 37.74,30.2 v36.99,30.2 | v25.59,25.25 25.59,25.06 24.95,24.42 24.27,24.42 U$1.31
  Bottom 0.16: v25.59,25.25 25.88,25.54 31.19,25.54 32.31,24.42 34.55,24.42 37.27,27.14 37.27,29.7 36.99,29.98 v36.99,30.2
SW
  Top 0.26: 16.6,24.63 D1.C 16.36,24.62 | C4.1 16.03,26.98
  Top 0.3: U$1.45 16.6,24.63
  pour Top (no thermals): 11.51,26.98 16.15,26.98 16.15,23.46 14.71,23.46 14.71,25.54 11.51,25.54
TCK  (via drill 0.3)
  Top 0.16: U$3.49 33.27,21.31 33.27,22.18 34.87,23.78 39.19,23.78 v40.31,24.9
  Bottom 0.16: v40.31,24.9 44.95,24.9 48.15,21.7 49.81,21.7 U$2.P$4
TMS  (via drill 0.3)
  Top 0.16: U$3.46 31.38,24.42 v38.87,24.42
  Bottom 0.16: v38.87,24.42 44.95,24.42 48.97,20.41 U$2.P$5
USART_RX  (via drill 0.3)
  Top 0.16: v46.71,30.34 46.71,32.9 46.39,33.22 41.18,33.22 U$3.17
  Bottom 0.16: U$2.P$18 51.51,19.14 52.15,19.78 52.15,25.7 51.51,26.34 50.55,26.34 v46.71,30.34
USART_TX  (via drill 0.3)
  Top 0.16: U$3.16 42.75,31.18 v43.03,31.46
  Bottom 0.16: v43.03,31.46 46.39,31.46 51.19,26.66 51.67,26.66 52.47,25.86 52.47,19.23 U$2.P$19
VCP
  Top 0.16: C6.2 17.31,18.18 U$1.5

### Text on the board
tNames: HKC Integrated / V2.2 Pendulum Edition / Ben Katz / 10/18 | :P | - | + | U | W | V